# EAGLE design untitled (EAGLE 9.6.2)
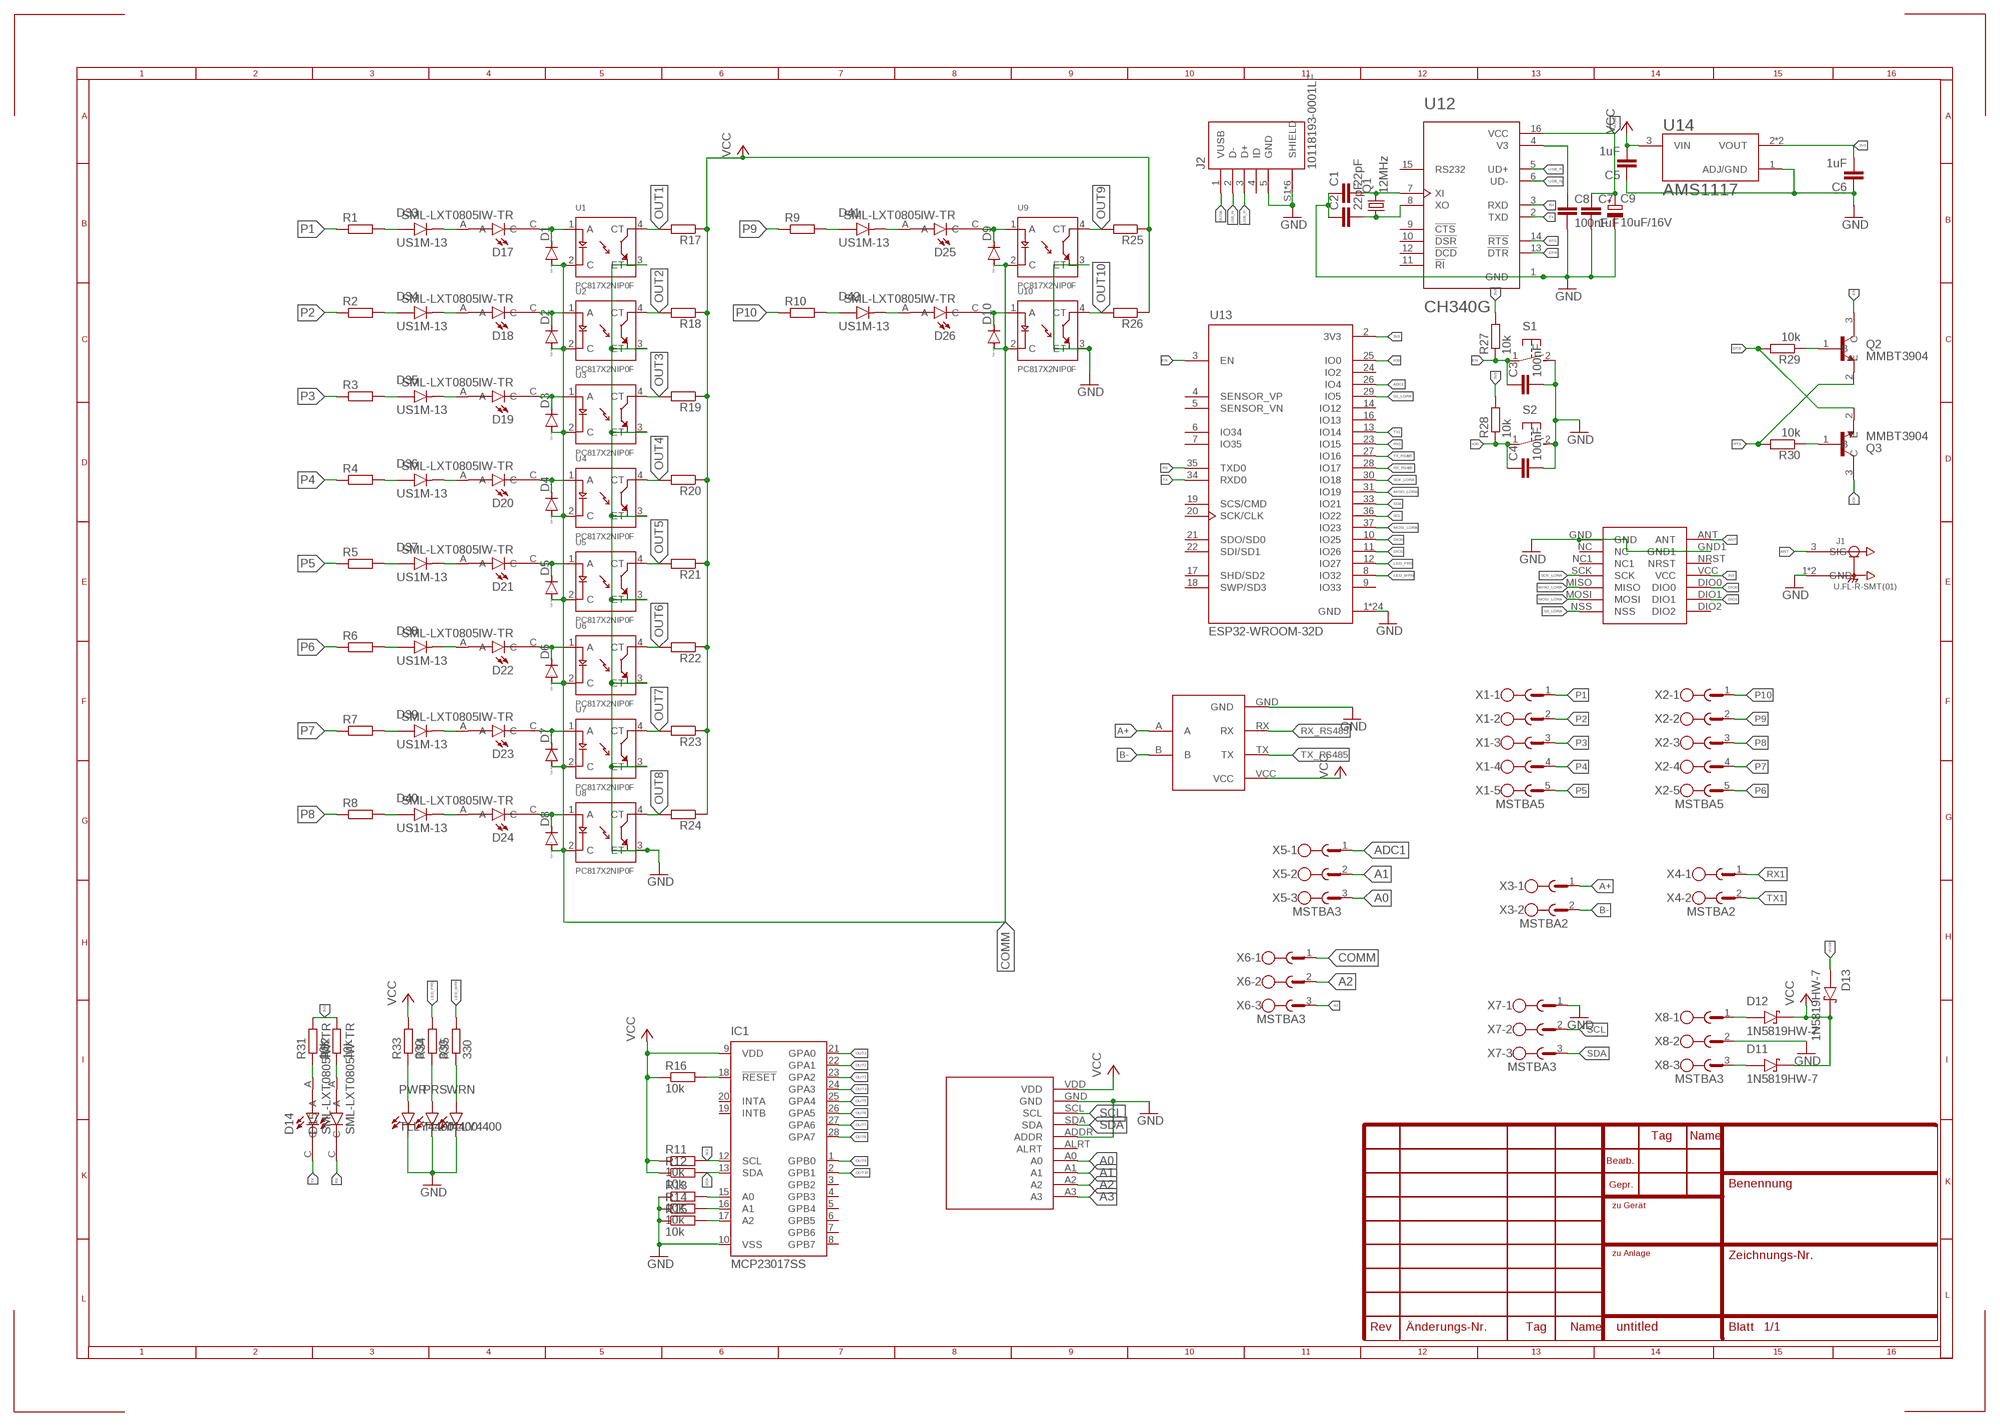
[diagram p0: schematic, sheet 1]

## Parts
ADS1  ADS1115  [ADS1115]
C1  22pF  C-EUC0805K  [C0805K]
C2  22pF  C-EUC0805K  [C0805K]
C3  100nF  C-EUC0805K  [C0805K]
C4  100nF  C-EUC0805K  [C0805K]
C5  1uF  C-EUC0805K  [C0805K]
C6  1uF  C-EUC0805K  [C0805K]
C7  1uF  C-EUC0805K  [C0805K]
C8  100nF  C-EUC0805K  [C0805K]
C9  10uF/16V  CPOL-EU153CLV-0505  [153CLV-0505]
D1  DIODE-SOD123  [SOD123]
D2  DIODE-SOD123  [SOD123]
D3  DIODE-SOD123  [SOD123]
D4  DIODE-SOD123  [SOD123]
D5  DIODE-SOD123  [SOD123]
D6  DIODE-SOD123  [SOD123]
D7  DIODE-SOD123  [SOD123]
D8  DIODE-SOD123  [SOD123]
D9  DIODE-SOD123  [SOD123]
D10  DIODE-SOD123  [SOD123]
D11  1N5819HW-7  [SOD3715X145N]
D12  1N5819HW-7  [SOD3715X145N]
D13  1N5819HW-7  [SOD3715X145N]
D14  SML-LXT0805IW-TR  [LEDC2012X120N]
D15  SML-LXT0805IW-TR  [LEDC2012X120N]
D17  SML-LXT0805IW-TR  [LEDC2012X120N]
D18  SML-LXT0805IW-TR  [LEDC2012X120N]
D19  SML-LXT0805IW-TR  [LEDC2012X120N]
D20  SML-LXT0805IW-TR  [LEDC2012X120N]
D21  SML-LXT0805IW-TR  [LEDC2012X120N]
D22  SML-LXT0805IW-TR  [LEDC2012X120N]
D23  SML-LXT0805IW-TR  [LEDC2012X120N]
D24  SML-LXT0805IW-TR  [LEDC2012X120N]
D25  SML-LXT0805IW-TR  [LEDC2012X120N]
D26  SML-LXT0805IW-TR  [LEDC2012X120N]
D33  US1M-13  [DIOM5226X240N]
D34  US1M-13  [DIOM5226X240N]
D35  US1M-13  [DIOM5226X240N]
D36  US1M-13  [DIOM5226X240N]
D37  US1M-13  [DIOM5226X240N]
D38  US1M-13  [DIOM5226X240N]
D39  US1M-13  [DIOM5226X240N]
D40  US1M-13  [DIOM5226X240N]
D41  US1M-13  [DIOM5226X240N]
D42  US1M-13  [DIOM5226X240N]
IC1  MCP23017SS  [SSOP28]
J1  U.FL-R-SMT(01)  [HRS_U.FL-R-SMT(01)]
J2  10118193-0001LF  [FCI_10118193-0001LF]
LORA-NICERF-V1  LORA-NICERF-V2  [LORA-NICERF-V2]
PRS  TLLY4400  [LED3MM]
PWR  TLLY4400  [LED3MM]
Q1  12MHz  CRYSTALSM49  [SM49]
Q2  MMBT3904  [SOT95P240X120-3N]
Q3  MMBT3904  [SOT95P240X120-3N]
R1  R-EU_0414/15  [0414/15]
R2  R-EU_0414/15  [0414/15]
R3  R-EU_0414/15  [0414/15]
R4  R-EU_0414/15  [0414/15]
R5  R-EU_0414/15  [0414/15]
R6  R-EU_0414/15  [0414/15]
R7  R-EU_0414/15  [0414/15]
R8  R-EU_0414/15  [0414/15]
R9  R-EU_0414/15  [0414/15]
R10  R-EU_0414/15  [0414/15]
R11  10k  R-EU_R0805  [R0805]
R12  10k  R-EU_R0805  [R0805]
R13  10k  R-EU_R0805  [R0805]
R14  10k  R-EU_R0805  [R0805]
R15  10k  R-EU_R0805  [R0805]
R16  10k  R-EU_R0805  [R0805]
R17  R-EU_R0805  [R0805]
R18  R-EU_R0805  [R0805]
R19  R-EU_R0805  [R0805]
R20  R-EU_R0805  [R0805]
R21  R-EU_R0805  [R0805]
R22  R-EU_R0805  [R0805]
R23  R-EU_R0805  [R0805]
R24  R-EU_R0805  [R0805]
R25  R-EU_R0805  [R0805]
R26  R-EU_R0805  [R0805]
R27  10k  R-EU_R0805  [R0805]
R28  10k  R-EU_R0805  [R0805]
R29  10k  R-EU_R0805  [R0805]
R30  10k  R-EU_R0805  [R0805]
R31  10k  R-EU_R0805  [R0805]
R32  10k  R-EU_R0805  [R0805]
R33  330  R-EU_R0805  [R0805]
R34  330  R-EU_R0805  [R0805]
R35  330  R-EU_R0805  [R0805]
S1  31-XX  [B3F-31XX]
S2  31-XX  [B3F-31XX]
TTL-RS1  TTL-RS485  [TTL-RS485]
U1  PC817X2NIP0F  [SOT254P975X400-4N]
U2  PC817X2NIP0F  [SOT254P975X400-4N]
U3  PC817X2NIP0F  [SOT254P975X400-4N]
U4  PC817X2NIP0F  [SOT254P975X400-4N]
U5  PC817X2NIP0F  [SOT254P975X400-4N]
U6  PC817X2NIP0F  [SOT254P975X400-4N]
U7  PC817X2NIP0F  [SOT254P975X400-4N]
U8  PC817X2NIP0F  [SOT254P975X400-4N]
U9  PC817X2NIP0F  [SOT254P975X400-4N]
U10  PC817X2NIP0F  [SOT254P975X400-4N]
U12  CH340G  [SOIC127P600X180-16N]
U13  ESP32-WROOM-32D  [MODULE_ESP32-WROOM-32D]
U14  AMS1117  [SOT229P700X180-4N]
WRN  TLLY4400  [LED3MM]
X1  MSTBA5  [MSTBA5]
X2  MSTBA5  [MSTBA5]
X3  MSTBA2  [MSTBA2]
X4  MSTBA2  [MSTBA2]
X5  MSTBA3  [MSTBA3]
X6  MSTBA3  [MSTBA3]
X7  MSTBA3  [MSTBA3]
X8  MSTBA3  [MSTBA3]

## Nets
3V3: C6.2 LORA-NICERF-V1.VCC R27.2 R28.2 R31.2 R32.2 U13.2(3V3) U14.2(VOUT) U14.4(VOUT)
A0: ADS1.A0 X5.3
A1: ADS1.A1 X5.2
A2: ADS1.A2 X6.2
A3: ADS1.A3 X6.3
A+: TTL-RS1.A X3.1
ADC1: U13.26(IO4) X5.1
ANT: J1.3(SIG) LORA-NICERF-V1.ANT
B-: TTL-RS1.B X3.2
COMM: D1.A D2.A D3.A D4.A D5.A D6.A D7.A D8.A D9.A D10.A U1.2(C) U2.2(C) U3.2(C) U4.2(C) U5.2(C) U6.2(C) U7.2(C) U8.2(C) U9.2(C) U10.2(C) X6.1
DIO0: LORA-NICERF-V1.DIO0 U13.10(IO25)
DIO1: LORA-NICERF-V1.DIO1 U13.11(IO26)
DTR: Q3.2(E) R29.2 U12.13(!DTR)
EN: C3.1 Q2.3(C) R27.1 S1.1(P) U13.3(EN)
GND: ADS1.ADDR ADS1.GND C1.1 C2.1 C3.2 C4.2 C5.1 C6.1 C7.2 C8.2 C9.- IC1.10(VSS) J1.1(GND) J1.2(GND) J2.5(GND) J2.S1(SHIELD) J2.S2(SHIELD) J2.S3(SHIELD) J2.S4(SHIELD) J2.S5(SHIELD) J2.S6(SHIELD) LORA-NICERF-V1.GND LORA-NICERF-V1.GND1 PRS.K(C) PWR.K(C) R13.1 R14.1 R15.1 S1.2(S) S2.2(S) TTL-RS1.GND U1.3(ET) U2.3(ET) U3.3(ET) U4.3(ET) U5.3(ET) U6.3(ET) U7.3(ET) U8.3(ET) U9.3(ET) U10.3(ET) U12.1(GND) U13.1(GND) U13.15(GND) U13.38(GND) U13.39_1(GND) U13.39_2(GND) U13.39_3(GND) U13.39_4(GND) U13.39_5(GND) U13.39_6(GND) U13.39_7(GND) U13.39_8(GND) U13.39_9(GND) U13.39_10(GND) U13.39_11(GND) U13.39_12(GND) U13.39_13(GND) U13.39_14(GND) U13.39_15(GND) U13.39_16(GND) U13.39_17(GND) U13.39_18(GND) U13.39_19(GND) U13.39_20(GND) U13.39_21(GND) U14.1(ADJ/GND) WRN.K(C) X7.1 X8.2
IO0: C4.1 Q3.3(C) R28.1 S2.1(P) U13.25(IO0)
LED_PRS: R34.2 U13.12(IO27)
LED_WRN: R35.2 U13.8(IO32)
MISO_LORA: LORA-NICERF-V1.MISO U13.31(IO19)
MOSI_LORA: LORA-NICERF-V1.MOSI U13.37(IO23)
N$1: D17.A D33.C(K)
N$2: D33.A R1.2
N$3: D1.C D17.C U1.1(A)
N$5: D34.A R2.2
N$6: D18.A D34.C(K)
N$7: D2.C D18.C U2.1(A)
N$8: D35.A R3.2
N$9: D19.A D35.C(K)
N$10: D3.C D19.C U3.1(A)
N$11: D36.A R4.2
N$12: D20.A D36.C(K)
N$13: D4.C D20.C U4.1(A)
N$15: D12.A X8.1
N$16: D11.A X8.3
N$17: D37.A R5.2
N$18: D21.A D37.C(K)
N$19: D5.C D21.C U5.1(A)
N$20: D38.A R6.2
N$21: D22.A D38.C(K)
N$22: D6.C D22.C U6.1(A)
N$23: IC1.18(!RESET) R16.2
N$24: C8.1 U12.4(V3)
N$25: D39.A R7.2
N$26: D23.A D39.C(K)
N$27: D7.C D23.C U7.1(A)
N$28: D40.A R8.2
N$29: D24.A D40.C(K)
N$30: D8.C D24.C U8.1(A)
N$31: PWR.A R33.1
N$32: IC1.15(A0) R13.2
N$33: D41.A R9.2
N$34: D25.A D41.C(K)
N$35: D9.C D25.C U9.1(A)
N$36: D42.A R10.2
N$37: D26.A D42.C(K)
N$38: D10.C D26.C U10.1(A)
N$39: IC1.16(A1) R14.2
N$40: IC1.17(A2) R15.2
N$41: PRS.A R34.1
N$42: D14.A R31.1
N$43: D15.A R32.1
N$44: R35.1 WRN.A
N$51: Q2.1(B) R29.1
N$52: Q3.1(B) R30.1
N$54: C1.2 Q1.2 U12.7(XI)
N$55: C2.2 Q1.1 U12.8(XO)
OUT1: IC1.21(GPA0) R17.2 U1.4(CT)
OUT2: IC1.22(GPA1) R18.2 U2.4(CT)
OUT3: IC1.23(GPA2) R19.2 U3.4(CT)
OUT4: IC1.24(GPA3) R20.2 U4.4(CT)
OUT5: IC1.25(GPA4) R21.2 U5.4(CT)
OUT6: IC1.26(GPA5) R22.2 U6.4(CT)
OUT7: IC1.27(GPA6) R23.2 U7.4(CT)
OUT8: IC1.28(GPA7) R24.2 U8.4(CT)
OUT9: IC1.1(GPB0) R25.2 U9.4(CT)
OUT10: IC1.2(GPB1) R26.2 U10.4(CT)
P1: R1.1 X1.1
P2: R2.1 X1.2
P3: R3.1 X1.3
P4: R4.1 X1.4
P5: R5.1 X1.5
P6: R6.1 X2.5
P7: R7.1 X2.4
P8: R8.1 X2.3
P9: R9.1 X2.2
P10: R10.1 X2.1
RTS: Q2.2(E) R30.2 U12.14(!RTS)
RX: D15.C U12.3(RXD) U13.35(TXD0)
RX1: U13.23(IO15) X4.1
RX_RS485: TTL-RS1.RX U13.28(IO17)
SCK_LORA: LORA-NICERF-V1.SCK U13.30(IO18)
SCL: ADS1.SCL IC1.12(SCL) R11.2 U13.36(IO22) X7.2
SDA: ADS1.SDA IC1.13(SDA) R12.2 U13.33(IO21) X7.3
SS_LORA: LORA-NICERF-V1.NSS U13.29(IO5)
TX: D14.C U12.2(TXD) U13.34(RXD0)
TX1: U13.13(IO14) X4.2
TX_RS485: TTL-RS1.TX U13.27(IO16)
USB_N: J2.2(D-) U12.6(UD-)
USB_P: J2.3(D+) U12.5(UD+)
VCC: ADS1.VDD C5.2 D11.C(K) D12.C(K) D13.C(K) IC1.9(VDD) R11.1 R12.1 R16.1 R17.1 R18.1 R19.1 R20.1 R21.1 R22.1 R23.1 R24.1 R25.1 R26.1 R33.2 TTL-RS1.VCC U14.3(VIN)
VUSB: C7.1 C9.+ D13.A J2.1(VUSB) U12.16(VCC)
Unconnected: ADS1.ALRT IC1.3(GPB2) IC1.4(GPB3) IC1.5(GPB4) IC1.6(GPB5) IC1.7(GPB6) IC1.8(GPB7) IC1.19(INTB) IC1.20(INTA) J2.4(ID) LORA-NICERF-V1.DIO2 LORA-NICERF-V1.NC LORA-NICERF-V1.NC1 LORA-NICERF-V1.NRST U12.9(!CTS) U12.10(!DSR) U12.11(!RI) U12.12(!DCD) U12.15(RS232) U13.4(SENSOR_VP) U13.5(SENSOR_VN) U13.6(IO34) U13.7(IO35) U13.9(IO33) U13.14(IO12) U13.16(IO13) U13.17(SHD/SD2) U13.18(SWP/SD3) U13.19(SCS/CMD) U13.20(SCK/CLK) U13.21(SDO/SD0) U13.22(SDI/SD1) U13.24(IO2)

## Library data of the parts
ADS1 = ds1115:ADS1115
C1-C8 = rcl:C-EU: CAPACITOR, European symbol; SPICEPREFIX: C
C9 = rcl:CPOL-EU: POLARIZED CAPACITOR, European symbol; SPICEPREFIX: C
D1-D10 = diode:DIODE-: DIODE
D11-D13 = 1N5819HW-7:1N5819HW-7: 1N5819HW Series 40 V 1 A Surface Mount Schottky Barrier Rectifier - SOD-123 Check availability <https://pricing.snapeda.com/parts/1N5819HW-7/Diodes%20Inc./view-part?ref=eda>; AVAILABILITY: In Stock; DESCRIPTION: Diode Schottky 40 V 1A Surface Mount SOD-123; MF: Diodes Inc.; MP: 1N5819HW-7; PACKAGE: SOD-123 Fairchild Semiconductor; PRICE: None; PURCHASE-URL: https://pricing.snapeda.com/search/part/1N5819HW-7/?ref=eda
D14 D15 D17-D26 = SML-LXT0805IW-TR:SML-LXT0805IW-TR: LED; Luminous Intensity:11µcd; Viewing Angle:140°; Forward Current:30mA; Forward Voltage:2V; Color:Red; LED Color:Red; Leaded Process Compatible:Yes; Lens Color:White; Mounting Type:Surface Mount ;RoHS Compliant: Yes Check availability <https://pricing.snapeda.com/parts/SML-LXT0805IW-TR/Lumex%20Opto/Components/view-part?ref=eda>; AVAILABILITY: In Stock; DESCRIPTION: Red - LED Indication - Discrete 2V 0805 (2012 Metric); MF: Lumex Opto/Components; MP: SML-LXT0805IW-TR; PACKAGE: 0805 Lumex; PRICE: None; PURCHASE-URL: https://pricing.snapeda.com/search/part/SML-LXT0805IW-TR/?ref=eda
D33-D42 = US1M-13:US1M-13: Diode, Fast Recovery, 1a, 1kv, Do-214ac-2, Full Reel Check availability <https://pricing.snapeda.com/parts/US1M-13/Diodes%20Incorporated/view-part?ref=eda>; AVAILABILITY: In Stock; DESCRIPTION: Diode Standard 1000 V 1A Surface Mount SMA; MF: Diodes Incorporated; MP: US1M-13; PACKAGE: DO-214AC-214 Diodes Incorporated; PRICE: None; PURCHASE-URL: https://pricing.snapeda.com/search/part/US1M-13/?ref=eda
IC1 = microchip:MCP23017: http://ww1.microchip.com/downloads/en/DeviceDoc/21952a.pdf Source: http://ww1.microchip.com/downloads/en/DeviceDoc/21952a.pdf; MF: MICROCHIP; MPN: MCP23017-E/SS; OC_FARNELL: 1467674; OC_NEWARK: 31K2960
J1 = U.FL-R-SMT_01_:U.FL-R-SMT(01): U.FL Series 6 Ghz 50 Ohm Ultra-small SMT Coaxial Cable Receptacle Check availability <https://pricing.snapeda.com/parts/U.FL-R-SMT%2801%29/Hirose/view-part?ref=eda>; AVAILABILITY: In Stock; DESCRIPTION: U.FL (UMCC) Connector Receptacle, Male Pin 50Ohm Surface Mount Solder. RF Connectors / Coaxial Connectors; MF: Hirose; MP: U.FL-R-SMT(01); PACKAGE: None; PRICE: None; PURCHASE-URL: https://pricing.snapeda.com/search/part/U.FL-R-SMT(01)/?ref=eda
J2 = 10118193-0001LF:10118193-0001LF: Micro USB B Type Receptacle Check availability <https://pricing.snapeda.com/parts/10118193-0001LF/FCI/view-part?ref=eda>; AVAILABILITY: In Stock; DESCRIPTION: USB - micro B USB 2.0 Receptacle Connector 5 Position Surface Mount, Right Angle; Through Hole; MF: FCI; MP: 10118193-0001LF; PACKAGE: None; PRICE: None; PURCHASE-URL: https://pricing.snapeda.com/search/part/10118193-0001LF/?ref=eda
LORA-NICERF-V1 = LORA-NICERF-V2:LORA-NICERF-V2
PRS PWR WRN = led:TLLY4400: Low Current (2mA) LED 3 mm Tinted Diffused Package color YELLOW Source: Data sheet <http://www.farnell.com/datasheets/391098.pdf>; MF: VISHAY SEMICONDUCTOR; OC_FARNELL: 1612439
Q1 = crystal:CRYSTAL: CRYSTAL; OC_FARNELL: unknown; OC_NEWARK: unknown
Q2 Q3 = MMBT3904:MMBT3904: MMBT3904 Series 40 V CE Breakdown 0.2 A NPN General Purpose Amplifier - SOT-23 Check availability <https://pricing.snapeda.com/parts/MMBT3904/ON%20Semiconductor/view-part?ref=eda>; AVAILABILITY: In Stock; DESCRIPTION: Bipolar (BJT) Transistor NPN 40 V 200 mA 300MHz 300 mW Surface Mount SOT-23-3 (TO-236); MF: ON Semiconductor; MP: MMBT3904; PACKAGE: SOT-23-3 Motorola; PRICE: None
R1-R35 = rcl:R-EU_: RESISTOR, European symbol; SPICEPREFIX: R
S1 S2 = switch-omron:31-XX: OMRON SWITCH; MPN: B3F-3100; OC_FARNELL: 959704; OC_NEWARK: 36M3582
TTL-RS1 = TTL-RS485:TTL-RS485
U1-U10 = PC817X2NIP0F:PC817X2NIP0F: PC817 Series 1 Channel 80 V 5000 Vrms General Purpose Photocoupler - DIP-4 Check availability <https://pricing.snapeda.com/parts/PC817X2NIP0F/Sharp%20Microelectronics/view-part?ref=eda>; AVAILABILITY: Not in stock; DESCRIPTION: Optoisolator Transistor Output 5000Vrms 1 Channel 4-SMD; MF: Sharp Microelectronics; MP: PC817X2NIP0F; PACKAGE: SMD-4 Sharp Microelectronics; PRICE: None
U12 = CH340G:CH340G: Check availability <https://pricing.snapeda.com/parts/Ch340G/WCH/view-part?ref=eda>; AVAILABILITY: Not in stock; DESCRIPTION: USB Interface Integrated Circuit; MF: WCH; MP: Ch340G; PACKAGE: None; PRICE: None
U13 = ESP32-WROOM-32D:ESP32-WROOM-32D: Bluetooth, WiFi 802.11b/g/n, Bluetooth v4.2 + EDR, Class 1, 2 and 3 Transceiver Module 2.4GHz ~ 2.5GHz Integrated, Trace Surface Mount Check availability <https://pricing.snapeda.com/parts/ESP32-WROOM-32D/Espressif%20Systems/view-part?ref=eda>; AVAILABILITY: In Stock; DESCRIPTION: Bluetooth, WiFi 802.11b/g/n, Bluetooth v4.2 +EDR, Class 1, 2 and 3 Transceiver Module 2.4GHz ~ 2.5GHz Integrated; MF: Espressif Systems; MP: ESP32-WROOM-32D; PACKAGE: Module Espressif Systems; PRICE: None; PURCHASE-URL: https://pricing.snapeda.com/search/part/ESP32-WROOM-32D/?ref=eda
U14 = AMS1117:AMS1117: Sot223/Pkg 1-Amp 5-Volt Low Drop Out Voltage Regulatator Check availability <https://pricing.snapeda.com/parts/AMS1117/Advanced%20Monolithic%20Systems/view-part?ref=eda>; AVAILABILITY: Not in stock; DESCRIPTION: 1A LOW DROPOUT VOLTAGE REGULATOR SOT-223; MF: Advanced Monolithic Systems; MP: AMS1117; PACKAGE: SOT-223 Seeed Technology; PRICE: None
X1 X2 = con-phoenix-508:MSTBA5: PHOENIX; MPN: 1757271; OC_FARNELL: 3705201; OC_NEWARK: 71C4164
X3 X4 = con-phoenix-508:MSTBA2: PHOENIX; MF: FARNELL; MPN: 1757242; OC_FARNELL: 3705171; OC_NEWARK: 71C4161
X5-X8 = con-phoenix-508:MSTBA3: PHOENIX; MF: FARNELL; MPN: 1757255; OC_FARNELL: 3705183; OC_NEWARK: 71C4162

## Board
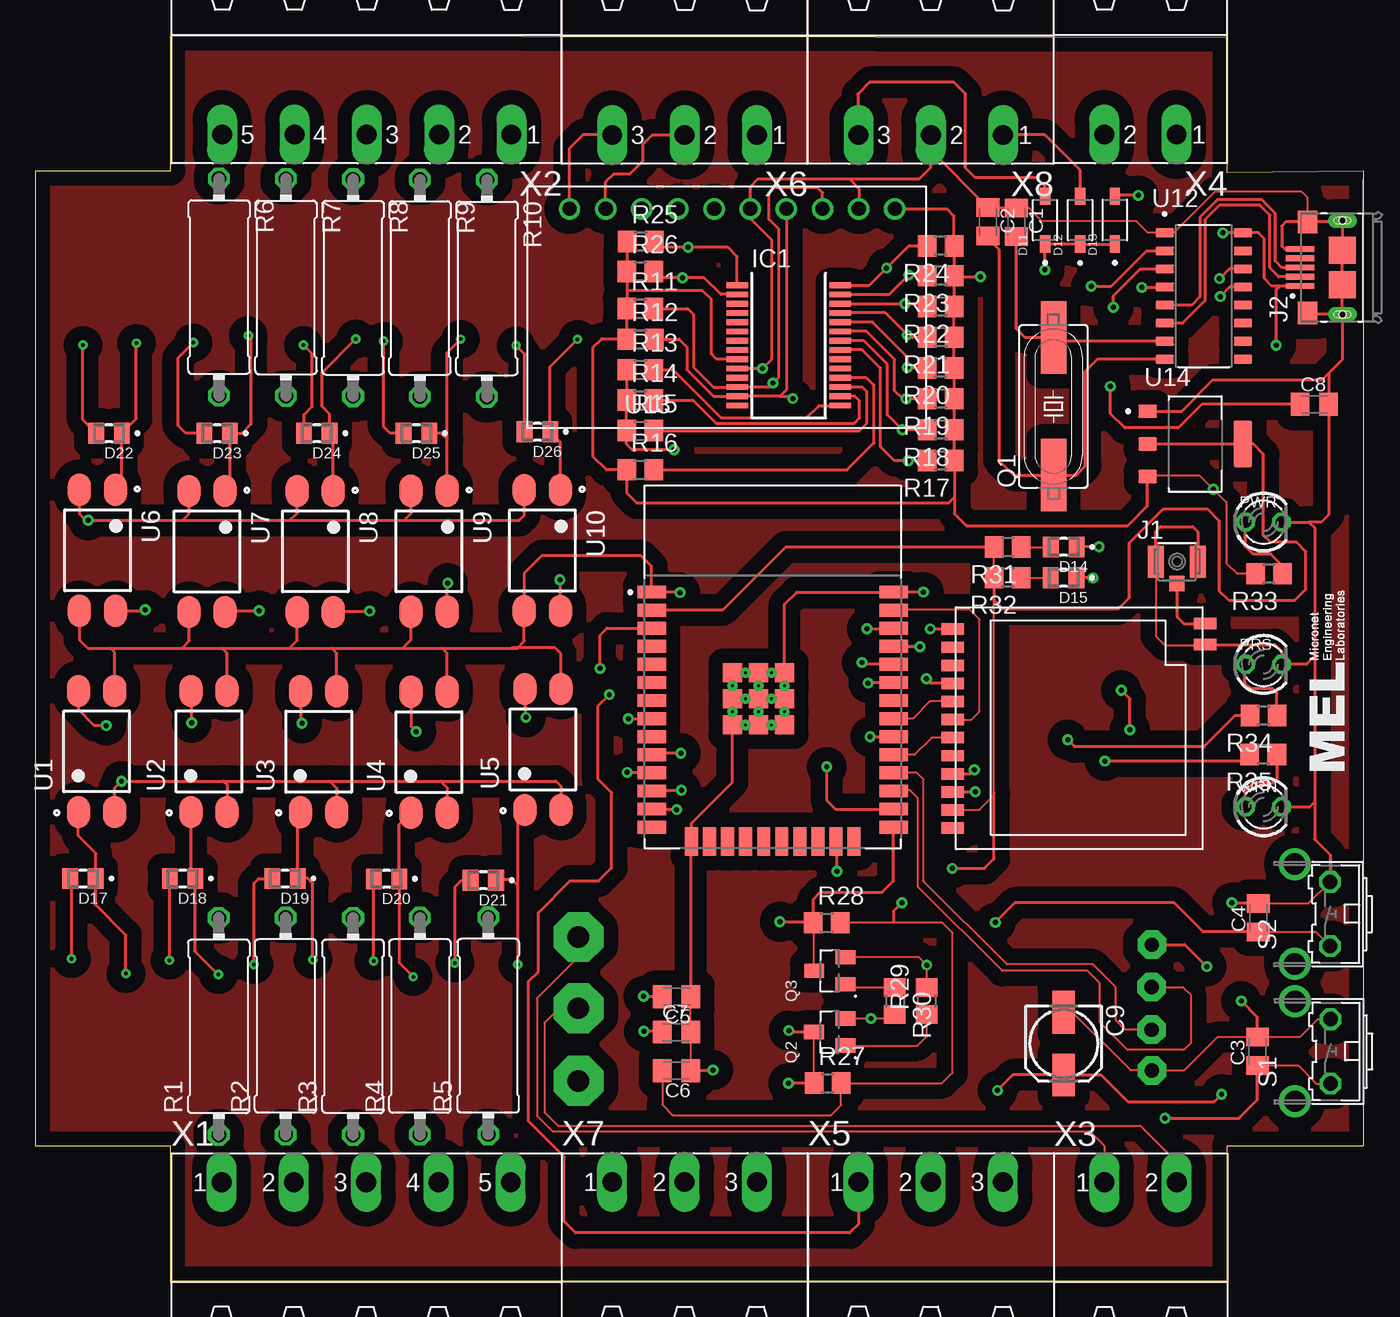
[diagram p1: board, top side]
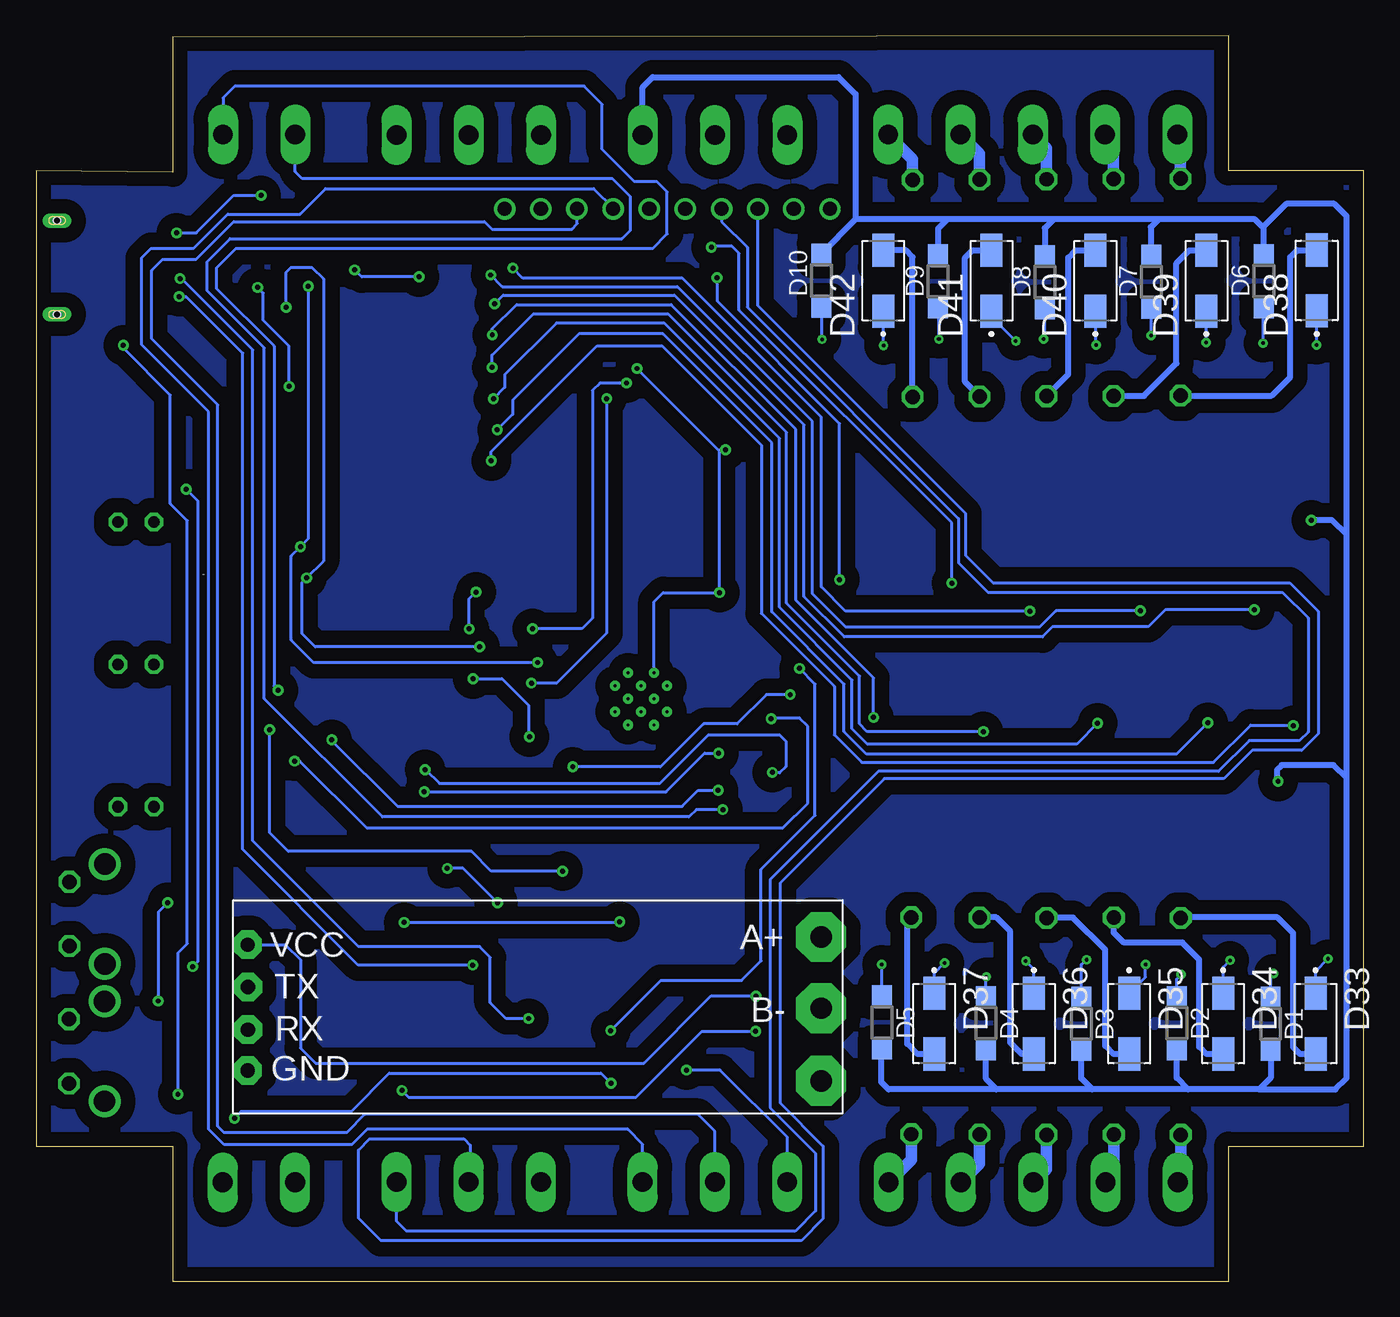
[diagram p2: board, bottom side, seen from below]

Size 93.3 x 87.5 mm. Coordinates in mm from the lower left corner, seen from the top.
Outline: 9.5,87.5 83.7,87.4 83.7,77.9 93.3,78 93.3,9.5 83.7,9.5 83.7,0 9.5,0 9.5,9.5 0,9.5 0,78 9.5,78 9.5,87.5
Copper layers (1*16): Top 0.035mm / dielectric 1.5mm / Bottom 0.035mm
Design rules "default *": minimum track width 6mil, minimum drill 0.25mm, track to track 6mil, track to pad 6mil, pad to pad 6mil, via to via 6mil, smd to smd 6mil, copper to edge 40mil, drill to drill 6mil, minimum pad ring 10mil, minimum via ring 8mil, stop-mask expansion 4mil, vias tented up to drill 0mil, thermal gap 10mil

### Footprints (pad centres in the part's own frame; a part is rotated, then mirrored left to right if it is on the bottom)
ADS1115 = drill 1: A0 -6.35,-1.27; A1 -6.35,-3.81; A2 -6.35,-6.35; A3 -6.35,-8.89; ADDR -6.35,3.81; ALRT -6.35,1.27; GND -6.35,11.43; SCL -6.35,8.89; SDA -6.35,6.35; VDD -6.35,13.97
C0805K = smd 1.3 x 1.6: 1 -1,0; 2 1,0
153CLV-0505 = smd 3 x 1.6: + 2.2,0; - -2.2,0
SOD123 = smd 1.4 x 1.4: A 1.9,0; C -1.9,0
SOD3715X145N = smd 1.21 x 0.73: A 1.68,0; C -1.68,0
LEDC2012X120N = smd 1.1 x 1.45: A 0.9,0; C -0.9,0
DIOM5226X240N = smd 2.33 x 1.55: A 2.135,0; C -2.135,0
SSOP28 = smd 0.4 x 1.5: 1 -4.225,-3.625; 2 -3.575,-3.625; 3 -2.925,-3.625; 4 -2.275,-3.625; 5 -1.625,-3.625; 6 -0.975,-3.625; 7 -0.325,-3.625; 8 0.325,-3.625; 9 0.975,-3.625; 10 1.625,-3.625; 11 2.275,-3.625; 12 2.925,-3.625; 13 3.575,-3.625; 14 4.225,-3.625; 15 4.225,3.625; 16 3.575,3.625; 17 2.925,3.625; 18 2.275,3.625; 19 1.625,3.625; 20 0.975,3.625; 21 0.325,3.625; 22 -0.325,3.625; 23 -0.975,3.625; 24 -1.625,3.625; 25 -2.275,3.625; 26 -2.925,3.625; 27 -3.575,3.625; 28 -4.225,3.625
HRS_U.FL-R-SMT(01) = smd 1.1 x 2.25: 1 -1.475,0; 2 1.475,0 | smd 1.05 x 1.1: 3 0,-1.55
FCI_10118193-0001LF = smd 0.4 x 2: 1 -1.3,2.975; 2 -0.65,2.975; 3 0,2.975; 4 0.65,2.975; 5 1.3,2.975 | smd 1.6 x 1.4: S1 -3.2,2.45; S2 3.2,2.45 | smd 1.9 x 1.9: S3 1.2,0; S4 -1.2,0 | drill 0.5 pad 0.9 long: S5 -3.3,0; S6 3.3,0 | hole 0.5: -3.3,0; 3.3,0
LORA-NICERF-V2 = smd 1.6 x 0.8: ANT 9.17,6.81; DIO0 -8.57,-5.03; DIO1 -8.57,-3.76; DIO2 -8.57,-2.49; GND -8.57,6.4; GND1 9.17,5.31; MISO -8.57,1.32; MOSI -8.57,0.05; NC -8.57,5.13; NC1 -8.57,3.86; NRST -8.57,-7.57; NSS -8.57,-1.22; SCK -8.57,2.59; VCC -8.57,-6.3
LED3MM = drill 0.813 octagon: A -1.27,0; K 1.27,0
SM49 = smd 5.08 x 1.778: 1 -4.826,0; 2 4.826,0
SOT95P240X120-3N = smd 1 x 1.4: 1 -0.95,-1.1; 2 0.95,-1.1; 3 0,1.1
0414/15 = drill 1.016 octagon: 1 -7.62,0; 2 7.62,0
R0805 = smd 1.3 x 1.5: 1 -0.95,0; 2 0.95,0
B3F-31XX = drill 1.016 octagon: 1 -2.261,-1.245; 2 2.261,-1.245 | drill 1.499 pad 2.159: 3 -3.505,1.245; 4 3.505,1.245
TTL-RS485 = drill 1.5 pad 3.5 octagon: A -19.7,-6; B -19.7,-1; P$7 -19.7,4.1 | drill 1 pad 2 octagon: GND 20.6,3.37; RX 20.581,0.505; TX 20.583,-2.493; VCC 20.6,-5.47
SOT254P975X400-4N = smd 2.25 x 1.6: 1 -4.25,1.27; 2 -4.25,-1.27; 3 4.25,-1.27; 4 4.25,1.27
SOIC127P600X180-16N = smd 1.31 x 0.62: 1 -2.75,4.445; 2 -2.75,3.175; 3 -2.75,1.905; 4 -2.75,0.635; 5 -2.75,-0.635; 6 -2.75,-1.905; 7 -2.75,-3.175; 8 -2.75,-4.445; 9 2.75,-4.445; 10 2.75,-3.175; 11 2.75,-1.905; 12 2.75,-0.635; 13 2.75,0.635; 14 2.75,1.905; 15 2.75,3.175; 16 2.75,4.445
MODULE_ESP32-WROOM-32D = smd 2 x 0.9: 1 -8.5,5.26; 2 -8.5,3.99; 3 -8.5,2.72; 4 -8.5,1.45; 5 -8.5,0.18; 6 -8.5,-1.09; 7 -8.5,-2.36; 8 -8.5,-3.63; 9 -8.5,-4.9; 10 -8.5,-6.17; 11 -8.5,-7.44; 12 -8.5,-8.71; 13 -8.5,-9.98; 14 -8.5,-11.25; 25 8.5,-11.25; 26 8.5,-9.98; 27 8.5,-8.71; 28 8.5,-7.44; 29 8.5,-6.17; 30 8.5,-4.9; 31 8.5,-3.63; 32 8.5,-2.36; 33 8.5,-1.09; 34 8.5,0.18; 35 8.5,1.45; 36 8.5,2.72; 37 8.5,3.99; 38 8.5,5.26 | smd 0.9 x 2: 15 -5.715,-12.25; 16 -4.445,-12.25; 17 -3.175,-12.25; 18 -1.905,-12.25; 19 -0.635,-12.25; 20 0.635,-12.25; 21 1.905,-12.25; 22 3.175,-12.25; 23 4.445,-12.25; 24 5.715,-12.25 | smd 1.33 x 1.33: 39_1 -2.835,-0.405; 39_2 -1,-0.405; 39_3 0.835,-0.405; 39_4 -2.835,-2.24; 39_5 -1,-2.24; 39_6 0.835,-2.24; 39_7 -2.835,-4.075; 39_8 -1,-4.075; 39_9 0.835,-4.075 | drill 0.2 pad 0.3: 39_10 -1.917,-0.405; 39_11 -0.083,-0.405; 39_12 -2.835,-1.323; 39_13 -1,-1.323; 39_14 0.835,-1.323; 39_15 -1.917,-2.24; 39_16 -0.083,-2.24; 39_17 -2.835,-3.158; 39_18 -1,-3.158; 39_19 0.835,-3.158; 39_20 -1.917,-4.075; 39_21 -0.083,-4.075
SOT229P700X180-4N = smd 1.31 x 0.93: 1 -3.345,2.29; 2 -3.345,0; 3 -3.345,-2.29 | smd 1.31 x 3.24: 4 3.345,0
MSTBA5 = drill 1.397 long: 1 -10.16,5.08; 2 -5.08,5.08; 3 0,5.08; 4 5.08,5.08; 5 10.16,5.08
MSTBA2 = drill 1.397 long: 1 -2.54,5.08; 2 2.54,5.08
MSTBA3 = drill 1.397 long: 1 -5.08,5.08; 2 0,5.08; 3 5.08,5.08

### Placement (x,y rotation side)
ADS1  46.41,68.99 270 top
C1  68.92,74.4 270 top
C2  66.91,74.42 270 top
C3  85.86,16.17 90 top
C4  85.92,25.54 90 top
C5  45.04,19.98 180 top
C6  45.04,14.78 180 top
C7  45.02,17.51 0 top
C8  89.86,61.61 0 top
C9  72.24,16.7 270 top
D1  6.56,18.09 270 bottom
D2  13.16,18.14 270 bottom
D3  19.86,18.09 270 bottom
D4  26.56,18.14 270 bottom
D5  33.86,18.19 270 bottom
D6  7.04,70.26 90 bottom
D7  14.94,70.21 90 bottom
D8  22.42,70.19 90 bottom
D9  29.92,70.24 90 bottom
D10  38.12,70.29 90 bottom
D11  70.93,74.54 90 top
D12  73.4,74.54 90 top
D13  75.84,74.54 90 top
D14  72.24,51.59 180 top
D15  72.23,49.42 180 top
D17  3.33,28.29 180 top
D18  10.33,28.29 180 top
D19  17.53,28.29 180 top
D20  24.66,28.27 180 top
D21  31.46,28.17 180 top
D22  5.16,59.57 180 top
D23  12.76,59.57 180 top
D24  19.76,59.57 180 top
D25  26.76,59.57 180 top
D26  35.26,59.67 180 top
D33  3.39,18.1 270 bottom
D34  9.89,18.1 270 bottom
D35  16.49,18.1 270 bottom
D36  23.19,18.1 270 bottom
D37  30.19,18.1 270 bottom
D38  3.31,70.3 90 bottom
D39  11.07,70.28 90 bottom
D40  18.87,70.28 90 bottom
D41  26.17,70.28 90 bottom
D42  33.77,70.28 90 bottom
IC1  52.92,65.74 270 top
J1  80.19,50.56 0 top
J2  91.82,71.21 90 top
LORA-NICERF-V1  73,39.41 0 top
PRS  86.28,43.33 0 top
PWR  86.28,53.33 0 top
Q1  71.52,61.46 90 top
Q2  55.8,17.51 90 top
Q3  55.81,21.82 90 top
R1  12.87,17.91 90 top
R2  17.57,17.93 90 top
R3  22.31,17.91 90 top
R4  27.01,17.93 90 top
R5  31.81,17.95 90 top
R6  12.89,69.83 270 top
R7  17.59,69.81 270 top
R8  22.31,69.79 270 top
R9  27.01,69.77 270 top
R10  31.71,69.75 270 top
R11  42.49,68.33 0 top
R12  42.51,66.17 0 top
R13  42.5,64.03 0 top
R14  42.49,61.89 0 top
R15  42.49,59.76 0 top
R16  42.47,57 0 top
R17  63.6,57.64 180 top
R18  63.59,59.81 180 top
R19  63.6,62 180 top
R20  63.59,64.16 180 top
R21  63.59,66.31 180 top
R22  63.59,68.46 180 top
R23  63.59,70.63 180 top
R24  63.59,72.73 180 top
R25  42.52,73.04 0 top
R26  42.5,70.93 0 top
R27  55.65,13.92 0 top
R28  55.59,25.19 0 top
R29  62.62,19.68 90 top
R30  60.37,19.68 270 top
R31  68.31,51.57 180 top
R32  68.3,49.42 180 top
R33  86.66,49.69 180 top
R34  86.28,39.73 180 top
R35  86.26,37 180 top
S1  89.74,16.15 90 top
S2  89.71,25.8 90 top
TTL-RS1  57.84,18.18 180 bottom
U1  4.29,37.22 90 top
U2  12.19,37.21 90 top
U3  19.89,37.2 90 top
U4  27.65,37.17 90 top
U5  35.65,37.36 90 top
U6  4.35,51.35 270 top
U7  12.05,51.26 270 top
U8  19.65,51.27 270 top
U9  27.65,51.28 270 top
U10  35.61,51.33 270 top
U12  82.09,69.21 0 top
U13  51.79,43.15 0 top
U14  81.48,58.82 0 top
WRN  86.28,33.33 0 top
X1  23.23,1.88 0 top
X2  23.27,85.63 180 top
X3  77.64,1.87 0 top
X4  77.63,85.63 180 top
X5  62.9,1.9 0 top
X6  45.6,85.6 180 top
X7  45.6,1.9 0 top
X8  62.9,85.6 180 top

### Tracks (layer width: path | path; a pad name or v marks a point on that pad's centre or on a via)
3V3  (via drill 0.35)
  Top 0.152: R31.2 67.35,51.56 R32.2 67.35,34.34 67.35,34.14 66.32,33.11 LORA-NICERF-V1.VCC | C6.2 44.04,12.41 44.77,11.68 55.9,11.68 56.6,12.37 R27.2 63.7,13.92 64.43,14.65 64.43,24.48 63.72,25.19 60.32,25.19 R28.2
  Top 0.203: R31.2 52.69,51.57 48.26,47.14 U13.2 | U14.2 U14.4 85.55,58.82 86.28,58.09 86.28,52.41 86.79,51.91 88.61,51.91 89.27,51.25 89.27,48.63 88.48,47.84 83.83,47.84 83.15,48.52 83.15,53.44 82.33,54.26 79.22,54.26 76.86,51.89 76.86,48.02 76.08,47.23 67.94,47.23 67.35,47.82 R32.2 | 60.32,25.19 60.32,26.03 v60.88,26.59 | v64.41,29 66.68,29 67.35,29.67 67.35,34.34
  Bottom 0.203: v60.88,26.59 63.29,29 v64.41,29
A0
  Bottom 0.203: ADS1.A0 45.14,74.43 43.33,72.62 43.33,68.43 28.48,53.58 28.48,50.46 26.42,48.39 5.72,48.39 3.92,46.6 3.92,38.58 4.53,37.98 8.06,37.98 10.22,35.83 34.11,35.83 41.73,28.21 41.73,12.2 38.52,8.99 38.52,4.94 39.94,3.52 67.27,3.52 67.98,4.23 X5.3
A1
  Bottom 0.203: ADS1.A1 42.6,68.55 27.99,53.94 27.99,50.99 26.06,49.06 5.22,49.06 3.21,47.05 3.21,38.46 4.37,37.3 7.86,37.3 9.85,35.3 33.7,35.3 41.03,27.97 41.03,12.53 38,9.5 38,4.4 39.53,2.86 69.07,2.86 70.65,4.44 70.65,9.22 69.87,10 63.23,10 62.79,9.56 62.79,7.09 X5.2
A2
  Top 0.203: ADS1.A2 40.06,77.22 40.63,77.79 41.76,77.79 42.67,78.7 42.67,79.86 43.33,80.52 X6.2
A3
  Top 0.203: ADS1.A3 37.52,79.57 38.51,80.57 40.47,80.57 X6.3
A+
  Top 0.152: TTL-RS1.A 38.14,22.8 35.23,19.89 35.23,11.63 36.32,10.54 74.07,10.54 75.1,9.51 X3.1
ADC1  (via drill 0.35)
  Top 0.203: X5.1 57.82,4.01 57.2,3.4 37.96,3.4 37.15,4.21 37.15,8.74 34.65,11.24 34.65,21.08 35.33,21.76 35.33,25.9 37.55,28.13 39.57,28.13 40.48,29.04 40.48,34.32 39.54,35.26 39.54,40.44 v40.31,41.22 | v40.31,41.22 | v55.59,36.13 55.59,33.77 56.2,33.17 U13.26
  Bottom 0.203: v40.31,41.22 41.99,41.22 44.05,39.16 46.4,39.16 49.43,36.13 v55.59,36.13
ANT
  Top 0.203: J1.3 80.19,46.67 80.67,46.19 82.15,46.19 LORA-NICERF-V1.ANT
B-
  Top 0.152: TTL-RS1.B 36.79,19.18 35.76,18.15 35.76,11.89 36.72,10.93 77.61,10.93 80.18,8.36 X3.2
COMM  (via drill 0.35)
  Top 0.203: U6.2 3.08,53.91 3.54,53.45 v3.69,53.45 10.32,53.45 | U7.2 10.78,53.91 10.32,53.45 | 10.32,53.45 17.86,53.45 | U8.2 18.38,53.97 17.86,53.45 | 17.86,53.45 25.89,53.45 | 25.89,53.45 26.39,53.95 26.39,55.52 U9.2 | 25.89,53.45 33.99,53.45 34.34,53.8 U10.2 | U1.2 5.56,34.65 v6.03,35.13 13.2,35.13 | U2.2 13.46,34.86 13.2,35.13 | 13.2,35.13 20.67,35.13 | U3.2 21.16,34.64 20.67,35.13 | 20.67,35.13 28.44,35.13 | U4.2 28.92,34.65 28.44,35.13 | 28.44,35.13 36.57,35.13 36.92,34.78 U5.2
  Bottom 0.406: D1.A 6.56,14.28 7.36,13.48 | 7.36,13.48 12.36,13.48 | D2.A 13.16,14.29 12.36,13.48 | 12.36,13.48 19.09,13.48 | D3.A 19.86,14.25 19.09,13.48 | 19.09,13.48 25.83,13.48 | D4.A 26.56,14.22 25.83,13.48 | 25.83,13.48 33.4,13.48 33.9,13.99 33.9,16.25 D5.A | D6.A 7.04,73.97 7.11,74.04 | 7.11,74.04 7.66,74.6 14.43,74.6 | 14.43,74.6 14.97,74.05 14.97,72.14 D7.A | 14.43,74.6 21.8,74.6 | D8.A 22.42,73.97 21.8,74.6 | 21.8,74.6 29.27,74.6 | 29.27,74.6 29.93,73.94 29.93,72.15 D9.A | 29.27,74.6 35.71,74.6 | 35.71,74.6 D10.A | 7.36,13.48 2,13.48 1.22,14.27 1.22,35.36 | 1.22,35.36 2.12,36.26 5.78,36.26 6.11,35.93 6.11,35.23 6.03,35.15 v6.03,35.13 | 1.22,35.36 1.22,52.42 | 1.22,52.42 2.27,53.47 3.69,53.47 v3.69,53.45 | X6.1 50.68,83.89 49.99,84.58 36.91,84.58 35.71,83.38 35.71,74.6 | 1.22,52.42 1.22,74.82 2.08,75.68 5.47,75.68 7.11,74.04
DIO0  (via drill 0.35)
  Top 0.203: LORA-NICERF-V1.DIO0 v66.02,34.38 | v45.34,37.09 43.4,37.09 U13.10
  Bottom 0.203: v66.02,34.38 49.04,34.38 46.32,37.09 v45.34,37.09
DIO1  (via drill 0.35)
  Top 0.203: LORA-NICERF-V1.DIO1 65.67,35.65 v65.96,35.94 | v41.57,35.75 43.26,35.75 U13.11
  Bottom 0.203: v65.96,35.94 65.92,35.94 64.97,34.98 49.47,34.98 46.06,38.39 41.07,38.39 40.61,37.94 40.61,36.15 41.05,35.71 41.54,35.71 v41.57,35.75
DTR  (via drill 0.35)
  Top 0.152: R29.2 v62.62,22.21 62.06,22.77 Q3.2
  Top 0.203: U12.13 83.92,69.84 83.25,69.17 v83.25,69.17
  Bottom 0.203: v62.62,22.21 70.66,22.21 78.78,30.33 78.78,65.19 82.75,69.17 v83.25,69.17
EN  (via drill 0.35)
  Top 0.152: C3.1 88.71,15.16 89.99,13.89 S1.1 | R27.1 Q2.3
  Top 0.203: R27.1 v52.91,13.92 | v79.36,11.45 84.55,11.45 85.86,12.75 C3.1 | Q2.3 53.02,17.51 v52.92,17.61 | v39.66,43.05 39.66,45.39 40.15,45.88 U13.3
  Bottom 0.203: v52.91,13.92 53.61,14.62 68.48,14.62 71.18,11.92 78.9,11.92 v79.36,11.45 | v52.92,17.61 49.4,21.14 43.72,21.14 42.36,22.5 42.36,28.94 38.56,32.74 38.56,41.95 v39.66,43.05
GND  (via drill 0.35)
  Top 0.152: J1.1 78.72,45.32 79.36,44.68 82.13,44.68 LORA-NICERF-V1.GND1 | S1.2 90.11,18.41 88.86,17.16 C3.2 83.06,17.16 80.7,14.81 TTL-RS1.GND 76.96,14.81 72.86,18.91 72.25,18.91 C9.- | C4.2 86.03,26.54 89.43,26.54 S2.2 | C1.1 69.78,75.4 70.71,74.48 77.33,74.48 78.16,73.65 U12.1 79.99,73.65 82.86,76.52 88.98,76.52 89.37,76.12 J2.S2 | C6.1 46.04,17.49 C7.2 46.02,19.96 C5.1
  Top 0.203: C1.1 68.9,75.42 C2.1 62.9,79.43 | R13.1 R14.1 R15.1 41.54,58.78 41.91,58.4 v44.86,58.4 | U6.3 3.08,45.06 3.67,44.48 5.26,44.48 | 5.26,44.48 10.28,44.48 | 10.28,44.48 10.8,44.99 10.8,46.98 U7.3 | 10.28,44.48 13.1,44.48 | 13.1,44.48 17.83,44.48 | U8.3 18.38,45.03 17.83,44.48 | 17.83,44.48 20.8,44.48 | 20.8,44.48 25.8,44.48 | U9.3 26.38,45.05 25.8,44.48 | 25.8,44.48 28.55,44.48 | 28.55,44.48 33.42,44.48 | 33.42,44.48 33.85,44.48 34.34,44.97 U10.3 34.34,49.74 35.55,50.96 42.56,50.96 43.29,50.22 U13.1 45.25,48.41 v45.28,48.38 | U5.3 36.92,44.08 36.5,44.5 33.45,44.5 33.42,44.48 | U4.3 28.92,44.1 28.55,44.48 | U3.3 21.16,44.11 20.8,44.48 | U2.3 13.46,44.12 13.1,44.48 | U1.3 5.56,44.17 5.26,44.48 | LORA-NICERF-V1.GND1 87.09,44.72 87.55,44.26 PRS.K 89.29,43.33 89.88,43.91 | PWR.K 89.47,53.33 | 89.47,53.33 89.88,52.92 89.88,43.91 | 89.88,43.91 89.88,33.68 | 89.88,33.68 89.49,33.29 87.6,33.29 WRN.K | 89.88,33.68 89.88,31.05 90.96,29.96 S2.2 | J1.1 78.72,52.7 79.03,53.02 81.3,53.02 81.67,52.65 J1.2 | 89.47,53.33 90.34,53.33 90.86,53.85 C8.2 90.86,63.77 | J2.S5 91.82,64.73 90.86,63.77 | J2.S5 89.47,67.91 J2.S1 | J2.S5 J2.S4 J2.S3 J2.S6 91.72,74.41 J2.S2 87.85,74.41 87.55,74.11 87.55,72.72 87.76,72.51 J2.5 | 62.9,79.43 X8.2 | 57.17,77.43 50.75,77.43 50.22,76.9 ADS1.ADDR 50.22,74.65 51.71,73.16 51.71,64.75 v51.08,64.12 IC1.10 | 57.17,77.43 57.87,76.73 57.87,75.37 ADS1.GND | 57.17,77.43 62.09,77.43 62.9,78.24 62.9,79.43 | U14.1 80.53,61.11 82.73,63.31 90.41,63.31 90.86,63.77 | C5.1 46.04,30.02 46.15,30.13 46.15,30.84 U13.15 46.08,32.16 48.96,35.04 U13.39_7 | v47.6,14.84 47.55,14.78 C6.1 | LORA-NICERF-V1.GND 62.88,45.81 v62.86,45.83
  Top 0.203: v62.38,48.41 U13.38 | U13.38 | U13.39_3 52.63,47.56 53.48,48.41 U13.38 | C3.2 85.86,18.55 v84.71,19.69 | v84.06,26.59 85.98,26.59 86.03,26.54
  Top 0.406: 48.99,42.75 U13.39_10 50.76,42.75 | 48.99,42.75 U13.39_1 | 50.76,42.75 U13.39_2 U13.39_11 U13.39_3 U13.39_14 52.63,40.92 | 52.63,40.92 U13.39_6 U13.39_19 U13.39_9 U13.39_21 U13.39_8 | 50.76,42.75 50.76,41.87 U13.39_13 U13.39_5 | 48.99,42.75 48.96,42.72 U13.39_12 U13.39_4 | U13.39_4 U13.39_15 50.72,40.91 | 50.72,40.91 U13.39_5 | U13.39_5 U13.39_16 51.72,40.92 52.63,40.92 | 50.72,40.91 50.72,40.07 U13.39_18 U13.39_8 | U13.39_4 U13.39_17 U13.39_7 U13.39_20 U13.39_8
  Bottom 0.203: X7.1 40.52,10.13 45.23,14.84 v47.6,14.84 | U13.39_10 49.88,47.74 49.24,48.38 v45.28,48.38 45.28,58.24 45.12,58.4 v44.86,58.4 45.38,58.4 51.08,64.1 v51.08,64.12 | v62.86,45.83 62.86,47.95 62.4,48.41 v62.38,48.41 | v84.06,26.59 84.71,25.94 v84.71,19.69
IO0  (via drill 0.35)
  Top 0.152: C4.1 89.96,24.54 S2.1 | Q3.3 54.71,24.99 54.71,25.13 R28.1
  Top 0.203: R28.1 54.64,26.83 55.13,27.31 59.48,27.31 60.29,28.13 U13.25 | C4.1 82.05,24.54 80,26.58 68.82,26.58 v67.44,25.2 | v52.29,25.25 54.45,25.25 54.71,24.99
  Bottom 0.203: v67.44,25.2 52.34,25.2 v52.29,25.25
LED_PRS  (via drill 0.35)
  Top 0.203: v72.52,38.04 73.02,37.55 82.09,37.55 84.28,39.73 R34.2 | v45.37,34.49 45.33,34.44 U13.12
  Bottom 0.203: v72.52,38.04 72.52,37.98 67.89,33.36 47.91,33.36 46.77,34.49 v45.37,34.49
LED_WRN  (via drill 0.35)
  Top 0.203: R35.2 84.84,36.53 75.68,36.53 75.67,36.54 v75.13,36.54 | v41.65,39.52 U13.8
  Bottom 0.203: v75.13,36.54 74.77,36.54 70.07,31.85 40.82,31.85 39.08,33.59 39.08,38.98 39.65,39.56 41.61,39.56 v41.65,39.52
MISO_LORA
  Top 0.152: LORA-NICERF-V1.MISO 62.85,40.73 61.65,39.52 U13.31
MOSI_LORA
  Top 0.152: LORA-NICERF-V1.MOSI 65.76,39.46 66.32,40.02 66.32,46.5 65.64,47.18 60.33,47.18 U13.37
N$1  (via drill 0.25)
  Top 0.203: v2.53,22.66 2.53,28.19 D17.A
  Bottom 0.203: D33.C 3.39,21.78 2.52,22.64 v2.52,22.65 v2.53,22.66
N$2
  Bottom 0.406: D33.A 4.49,15.96 4.98,16.46 4.98,24.46 6.08,25.57 12.83,25.57 R1.2
N$3  (via drill 0.25)
  Top 0.203: v6.35,21.61 6.35,24.31 4.22,26.43 D17.C 4.23,30.07 2.99,31.31 2.99,32.94 U1.1
  Bottom 0.203: D1.C 6.56,21.38 v6.34,21.6 v6.35,21.61
N$4
  pour Bottom (isolate 1.016): 0,78 9.5,78 9.5,87.5 83.7,87.5 83.7,78 93.3,78 93.3,9.5 83.7,9.5 83.7,0 9.5,0 9.5,9.5 0,9.5
N$5
  Bottom 0.406: D34.A 11.07,15.96 11.57,16.47 11.57,22.6 12.76,23.79 16.86,23.79 17.57,24.5 R2.2
N$6  (via drill 0.25)
  Top 0.203: v9.42,22.55 9.42,28.28 D18.A
  Bottom 0.203: D34.C 9.89,22.07 v9.42,22.55
N$7  (via drill 0.25)
  Top 0.203: v12.85,21.54 11.23,23.16 D18.C 10.92,28.6 U2.1
  Bottom 0.203: D2.C 13.16,21.23 v12.85,21.54
N$8
  Bottom 0.406: D35.A 17.6,15.96 18.18,16.55 18.18,23.29 20.44,25.55 22.29,25.55 R3.2
N$9  (via drill 0.25)
  Top 0.203: D19.A 15.67,28.29 15.35,27.97 v15.35,22.24
  Bottom 0.203: D35.C 15.35,21.38 v15.35,22.24
N$10  (via drill 0.25)
  Top 0.203: v19.48,22.59 19.48,27.94 19.1,28.32 18.46,28.32 D19.C 18.43,32.76 U3.1
  Bottom 0.203: D3.C 19.86,22.24 19.5,22.6 v19.49,22.6 v19.48,22.59
N$11
  Bottom 0.406: D36.A 24.05,15.96 24.85,16.77 24.85,24.57 25.84,25.56 R4.2
N$12  (via drill 0.25)
  Top 0.203: v23.76,22.5 D20.A
  Bottom 0.203: D36.C 23.19,21.93 v23.76,22.5
N$13  (via drill 0.25)
  Top 0.203: v26.53,21.39 25.56,22.36 D20.C 25.56,32.1 U4.1
  Bottom 0.203: D4.C 26.56,21.36 v26.53,21.39
N$14
  pour Top (isolate 1.016): 0,78 9.5,78 9.5,87.5 83.7,87.5 83.7,78 93.3,78 93.3,9.5 83.7,9.5 83.7,0 9.5,0 9.5,9.5 0,9.5
N$15
  Top 0.203: D12.A 73.4,78.03 70.91,80.52 X8.1
N$16
  Top 0.203: D11.A 70.93,76.92 70.33,77.52 66.04,77.52 65.35,78.22 65.35,83.41 64.54,84.21 58.6,84.21 57.78,83.39 57.78,80.56 X8.3
N$17
  Bottom 0.406: D37.A 31.37,15.96 32.08,16.68 32.08,25.3 R5.2
N$18  (via drill 0.25)
  Top 0.203: v29.47,22.37 29.47,27.71 29.93,28.17 D21.A
  Bottom 0.203: D37.C 30.19,21.64 v29.47,22.37
N$19  (via drill 0.25)
  Top 0.203: v33.89,22.26 33.89,27.78 | 33.89,27.78 33.47,28.2 32.4,28.2 D21.C | 33.89,27.78 33.89,32.62 U5.1
  Bottom 0.203: D5.C 33.86,22.23 v33.89,22.26
N$20
  Bottom 0.406: R6.2 6.49,62.21 5.19,63.51 5.19,71.93 4.69,72.44 D38.A
N$21  (via drill 0.25)
  Top 0.203: D22.A 3.32,60.51 v3.32,65.76
  Bottom 0.203: v3.32,65.76 3.32,68.15 D38.C
N$22  (via drill 0.25)
  Top 0.203: U6.1 6.06,56.04 D22.C 7.08,60.59 v7.08,65.89
  Bottom 0.203: v7.08,65.89 7.08,68.31 D6.C
N$23
  Top 0.203: R16.2 57.02,57 58.91,58.9 58.91,62.95 58.39,63.47 IC1.18
N$24  (via drill 0.35)
  Top 0.203: C8.1 81.95,61.61 80.29,59.95 76.53,59.95 75.52,60.95 v75.52,62.85 | v77.74,69.81 79.31,69.81 U12.4
  Bottom 0.203: v75.52,62.85 75.52,65.69 77.33,67.5 77.33,69.41 v77.74,69.81
N$25
  Bottom 0.406: R7.2 15.46,62.19 13.16,64.48 13.16,71.52 12.27,72.42 D39.A
N$26  (via drill 0.25)
  Top 0.203: D23.A 10.55,59.57 10.03,60.1 10.03,64.88 v11.08,65.93
  Bottom 0.203: v11.08,65.93 D39.C
N$27  (via drill 0.25)
  Top 0.203: U7.1 13.66,55.85 D23.C 14.51,59.57 15.16,60.23 15.16,66.22 v14.94,66.44
  Bottom 0.203: v14.94,66.44 D7.C
N$28
  Bottom 0.406: R8.2 20.78,63.7 20.78,71.91 20.28,72.42 D40.A
N$29  (via drill 0.25)
  Top 0.203: D24.A 18.86,60.88 19.44,61.46 19.44,65.14 v18.83,65.76
  Bottom 0.203: v18.83,65.76 18.83,68.1 D40.C
N$30  (via drill 0.25)
  Top 0.203: U8.1 20.92,59.31 D24.C 20.66,60.92 20.12,61.46 20.12,63.83 22.49,66.19 | 22.49,66.19 | 22.49,66.19 v22.5,66.18
  Bottom 0.203: v22.5,66.18 22.42,66.27 D8.C
N$31
  Top 0.203: R33.1 87.61,50.27 86.81,51.07 85.55,51.07 84.99,51.63 84.99,53.31 PWR.A
N$32
  Top 0.203: R13.2 44.8,64.03 48.17,60.66 54.18,60.66 55.03,61.52 IC1.15
N$33
  Bottom 0.406: R9.2 28.03,63.17 28.03,71.91 27.52,72.42 D41.A
N$34  (via drill 0.25)
  Top 0.203: D25.A 24.91,59.57 24.46,60.03 v24.46,66.04
  Bottom 0.203: D41.C 26.17,67.75 v24.46,66.04
N$35  (via drill 0.25)
  Top 0.203: U9.1 28.92,59.15 | D25.C 28.5,59.57 28.92,59.15 | 28.92,59.15 28.92,65.23 v29.86,66.17
  Bottom 0.203: v29.86,66.17 29.86,68.28 D9.C
N$36
  Bottom 0.406: R10.2 31.71,71.94 32.18,72.42 D42.A
N$37  (via drill 0.25)
  Top 0.203: D26.A 34.36,65.12 v33.76,65.72
  Bottom 0.203: v33.76,65.72 33.76,68.13 D42.C
N$38  (via drill 0.25)
  Top 0.203: U10.1 36.88,58.95 D26.C 36.16,64.25 v38.08,66.17
  Bottom 0.203: v38.08,66.17 38.08,68.35 D10.C
N$39
  Top 0.203: R14.2 46.19,61.89 47.8,60.29 57.54,60.29 57.9,60.65 57.9,61.84 57.57,62.17 IC1.16
N$40
  Top 0.203: R15.2 57.9,59.76 58.41,60.27 58.41,62.5 58.09,62.82 IC1.17
N$41
  Top 0.203: R34.1 87.23,41.33 86.94,41.62 85.37,41.62 84.98,42.02 84.98,43.3 PRS.A
N$42
  Top 0.152: R31.1 71.32,51.57 D14.A
N$43
  Top 0.152: R32.1 D15.A
N$44
  Top 0.203: WRN.A 85.01,34.48 85.55,35.02 86.94,35.02 87.24,35.32 87.24,36.97 R35.1
N$51
  Top 0.152: Q2.1 61.96,16.56 62.62,17.22 R29.1
N$52
  Top 0.152: R30.1 57.15,20.63 Q3.1
N$54
  Top 0.203: U12.7 71.78,66.03 Q1.2 69.56,66.29 68.92,66.92 C1.2
N$55
  Top 0.203: U12.8 79.31,64.79 74.64,64.79 73.77,63.91 73.77,57.29 73.12,56.63 Q1.1 68.75,56.63 67.7,57.69 67.7,72.49 66.92,73.27 C2.2
OUT1  (via drill 0.35)
  Top 0.203: R17.2 v61.31,57.64 60.35,57.64 59.37,58.62 59.37,64.14 58.08,65.44 56.56,65.44 IC1.21 | v4.96,39.04 4.14,39.04 3.02,40.15 U1.4
  Bottom 0.203: v61.31,57.64 61.31,58.28 53.88,65.71 49.31,65.71 42.33,58.73 42.33,46.92 37.21,41.8 37.21,38.39 35.28,36.46 10.57,36.46 7.96,39.07 5,39.07 v4.96,39.04
OUT2  (via drill 0.35)
  Top 0.203: R18.2 v60.9,59.81 59.84,60.86 59.84,64.43 58.19,66.08 56.55,66.08 IC1.22 | U2.4 10.92,39.27 v10.96,39.23
  Bottom 0.203: v10.96,39.23 13.17,37.02 34.95,37.02 36.53,38.61 36.53,41.95 41.6,47.02 41.6,58.89 49.26,66.55 55.16,66.55 59.81,61.9 59.81,60.9 v60.9,59.81
OUT3  (via drill 0.35)
  Top 0.203: R19.2 v61.17,61.99 60.93,61.99 60.36,62.56 60.36,64.75 58.4,66.72 IC1.23 | U3.4 18.62,39.3 v18.72,39.2
  Bottom 0.203: v18.72,39.2 20.18,37.74 34.89,37.74 35.96,38.81 35.96,42.23 41.07,47.34 41.07,59.22 49.16,67.31 56.74,67.31 60.38,63.67 60.38,62.79 v61.17,61.99
OUT4  (via drill 0.35)
  Top 0.203: R20.2 61.3,64.16 v61.27,64.19 61.27,64.9 58.81,67.37 IC1.24 | U4.4 26.38,38.98 v26.75,38.62
  Bottom 0.203: v26.75,38.62 34.9,38.62 35.44,39.15 35.44,42.51 40.56,47.63 40.56,59.62 48.9,67.96 58.36,67.96 61.27,65.05 v61.27,64.19
OUT5  (via drill 0.35)
  Top 0.203: R21.2 61.64,66.31 61.47,66.47 v61.24,66.47 59.7,68.02 IC1.25 | U5.4 34.38,39.68 v34.45,39.61
  Bottom 0.203: v34.45,39.61 34.45,42.38 39.92,47.85 39.92,59.85 48.68,68.61 59.53,68.61 61.24,66.89 v61.24,66.47
OUT6  (via drill 0.35)
  Top 0.203: IC1.26 v61.08,68.67 62.44,68.67 R22.2 | U6.4 7.62,47.1 7.69,47.16 v7.7,47.16
  Bottom 0.203: v7.7,47.16 13.96,47.16 15.15,45.98 21.88,45.98 22.59,45.27 36.51,45.27 39.33,48.09 39.33,60.15 48.45,69.28 60.47,69.28 v61.08,68.67
OUT7  (via drill 0.35)
  Top 0.203: IC1.27 59.99,69.32 v61.35,70.68 62.59,70.68 R23.2 | U7.4 13.41,47.1 v15.71,47.1
  Bottom 0.203: v15.71,47.1 21.64,47.1 22.79,45.95 36.4,45.95 38.76,48.31 38.76,60.4 48.23,69.87 60.54,69.87 v61.35,70.68
OUT8  (via drill 0.35)
  Top 0.203: IC1.28 58.6,69.97 v59.8,71.17 61.37,72.74 62.63,72.74 R24.2 | U8.4 20.98,47.08 v23.48,47.08
  Bottom 0.203: v23.48,47.08 36.42,47.08 38.13,48.79 38.13,60.7 47.9,70.47 59.1,70.47 59.78,71.15 59.78,71.19 v59.8,71.17
OUT9  (via drill 0.35)
  Top 0.203: IC1.1 49.29,71.98 48.64,72.63 v45.86,72.63 43.89,72.63 R25.2 | U9.4 28.92,49 v28.96,49.05
  Bottom 0.203: v28.96,49.05 28.96,53.27 43.9,68.21 43.9,72.21 44.41,72.72 45.76,72.72 v45.86,72.62 v45.86,72.63
OUT10  (via drill 0.35)
  Top 0.203: IC1.2 48.15,69.32 46.98,70.49 v45.45,70.49 43.9,70.49 R26.2 | U10.4 36.88,49.25 v36.84,49.29
  Bottom 0.203: v36.84,49.29 36.84,60.25 45.45,68.86 v45.45,70.49 45.45,70.5
P1
  Bottom 0.813: X1.1 12.87,7.16 R1.1
P2
  Bottom 0.813: X1.2 17.57,7.54 R2.1
P3
  Bottom 0.813: X1.3 22.31,7.88 R3.1
P4
  Bottom 0.813: X1.4 27.01,8.26 R4.1
P5
  Bottom 0.813: X1.5 31.81,8.54 R5.1
P6
  Bottom 0.813: X2.5 12.89,80.33 R6.1
P7
  Bottom 0.813: X2.4 17.59,79.95 R7.1
P8
  Bottom 0.813: X2.3 22.31,79.59 R8.1
P9
  Bottom 0.813: X2.2 27.01,79.21 R9.1
P10
  Bottom 0.813: X2.1 31.71,78.83 R10.1
RTS  (via drill 0.35)
  Top 0.152: R30.2 60.1,18.46 v58.69,18.46 Q2.2
  Top 0.203: U12.14 83.88,71.11 83.21,70.43 v83.19,70.43
  Bottom 0.203: v58.69,18.46 60.27,18.46 61.38,19.57 61.38,22.76 62.13,23.5 70.64,23.5 78.08,30.94 78.08,65.43 83.11,70.46 83.16,70.46 v83.19,70.43
RX  (via drill 0.35)
  Top 0.203: U13.35 62.1,44.6 v62.13,44.57 | v74.29,49.41 73.14,49.41 D15.C | v75.73,68.42 75.73,69.24 77.61,71.11 U12.3
  Bottom 0.203: v62.13,44.57 73.69,44.57 74.61,45.49 74.61,49.09 v74.29,49.41 73.11,50.59 73.11,70.41 73.92,71.22 75.39,71.22 75.73,70.87 v75.73,68.42
RX1  (via drill 0.35)
  Top 0.203: U13.23 56.28,30.87 56.28,28.82 v56.29,28.81 v56.3,28.81 | v76.89,38.75 76.89,40.91 v76.28,41.52
  Bottom 0.203: v56.3,28.81 61.33,28.81 62.71,30.2 75.58,30.2 76.89,31.51 v76.89,38.75 | v76.28,41.52 76.59,41.82 76.59,65.7 80.62,69.73 80.62,71.19 79.25,72.56 49.97,72.56 48.95,73.57 48.95,76.53 49.67,77.25 51.27,77.25 53.52,79.5 53.52,82.67 54.79,83.95 79.34,83.95 80.17,83.12 X4.1
RX_RS485
  Top 0.152: TTL-RS1.RX 76.55,17.68 75.89,18.33 75.89,20.66 74.29,22.27 68.23,22.27 62.4,28.11 62.4,35.25 61.93,35.72 U13.28
SCK_LORA  (via drill 0.35)
  Top 0.203: LORA-NICERF-V1.SCK 62.92,42 v62.59,42.33 | v58.64,38.24 58.65,38.25 U13.30
  Bottom 0.203: v62.59,42.33 60.56,42.33 58.68,40.45 58.68,38.29 v58.64,38.24
SCL  (via drill 0.35)
  Top 0.203: R11.2 45.84,68.33 46.24,67.92 46.24,64.2 47.63,62.82 IC1.12 51.53,62.82 v51.82,63.1 52.22,63.5 52.22,73.9 51.53,74.6 51.53,76.43 51.91,76.82 54.95,76.82 55.3,76.47 ADS1.SCL | v58.41,45.84 60.26,45.84 U13.36
  Bottom 0.203: v51.82,63.1 53.68,63.1 54.2,62.58 54.2,46.58 54.95,45.84 v58.41,45.84 | X7.2 45.6,10.53 46.79,11.72 70.21,11.72 71.48,10.45 80.09,10.45 80.53,10.89 80.53,61.56 85.17,66.2 85.17,71.02 84.41,71.77 82.07,71.77 79.41,74.43 61.8,74.43 61.28,73.91 55.66,73.91 55.28,74.29 55.28,75.31 ADS1.SCL
SDA  (via drill 0.35)
  Top 0.203: R12.2 45.22,66.17 45.77,65.63 45.77,64.03 47.64,62.17 IC1.13 52.3,62.16 | ADS1.SDA 52.76,62.62 52.3,62.16 | 52.3,62.16 53.05,62.16 v53.2,62 | v58.5,42.02 58.54,42.06 U13.33
  Bottom 0.203: v53.2,62 53.2,45.53 56.72,42.02 v58.5,42.02 | X7.3 50.68,9.63 51.72,10.67 70.06,10.67 71.13,9.6 80.08,9.6 81.17,10.69 81.17,61.07 85.89,65.79 85.89,71.89 85.22,72.56 82.23,72.56 79.83,74.96 74.75,74.96 72.96,76.75 54.13,76.75 52.74,75.36 ADS1.SDA
SS_LORA
  Top 0.152: LORA-NICERF-V1.NSS 62.97,38.19 61.77,36.98 U13.29
TX  (via drill 0.35)
  Top 0.203: U13.34 58.2,43.33 v58.06,43.47 | v74.73,51.6 74.71,51.59 D14.C | v74.17,69.89 75.58,69.89 78.07,72.38 U12.2
  Bottom 0.203: v58.06,43.47 73.8,43.47 75.37,45.04 75.37,50.96 v74.73,51.6 74.17,52.16 v74.17,69.89
TX1  (via drill 0.35)
  Top 0.203: U13.13 45.01,33.17 v45.05,33.14
  Bottom 0.203: v45.05,33.14 46.91,33.14 47.42,32.62 68.96,32.62 77.27,40.94 77.27,65.56 81.29,69.59 81.29,71.61 79.67,73.23 52.14,73.23 51.54,73.83 51.54,76.18 52.81,77.45 74.59,77.45 75.09,77.94 X4.2
TX_RS485
  Top 0.152: TTL-RS1.TX 80.62,20.67 81.16,20.14 81.16,16.73 80.68,16.25 76.73,16.25 74.77,18.21 74.77,20.95 73.92,21.8 67.92,21.8 61.99,27.73 61.99,33.94 61.44,34.49 60.34,34.49 U13.27
USB_N
  Top 0.203: J2.2 87.35,70.56 86.73,71.18 86.73,74.9 86.03,75.6 83.19,75.6 82.17,74.58 82.17,68.86 80.59,67.28 79.36,67.28 U12.6
USB_P
  Top 0.203: J2.3 87.55,71.21 87.09,71.67 87.09,75.04 86.28,75.85 | 86.28,75.85 | 86.28,75.85 86.17,75.95 83.04,75.95 82.94,75.85 | 82.94,75.85 | 82.94,75.85 81.81,74.73 81.81,69.16 81.23,68.57 U12.5
VCC  (via drill 0.35)
  Top 0.152: R33.2 84.42,49.7 83.67,50.45 83.67,54.72 v82.75,55.63 81.81,56.58 78.18,56.58 U14.3
  Top 0.203: R23.1 R24.1 64.54,74.82 64.02,75.34 ADS1.VDD | R23.1 R22.1 R21.1 R20.1 64.55,64.15 R19.1 64.55,61.99 R18.1 64.55,59.81 R17.1 64.55,55.06 | R25.1 41.57,70.96 R26.1 41.55,69.59 | 41.55,69.59 41.55,68.34 R11.1 41.53,66.19 | 41.53,66.19 R12.1 | 41.53,66.19 41.52,66.21 39.79,66.21 39.17,65.59 39.17,57.93 40.11,57 R16.1 41.52,55.38 42.23,54.67 64.16,54.67 64.55,55.06 | D13.C 75.83,72.86 D12.C D11.C 70.91,72.85 v70.91,71.04 | 64.55,55.06 64.55,53.93 65.41,53.07 76.73,53.07 78.13,54.47 U14.3 | v42.72,20.03 43.99,20.03 C5.2 | IC1.9 47.85,64.77 47.48,65.14 47.48,68.97 46.85,69.59 41.55,69.59 | TTL-RS1.VCC 80.75,23.65 v82.29,22.11 | R23.1 64.62,70.55 v66.38,70.55
  Bottom 0.203: TTL-RS1.VCC 75.79,23.65 74.73,22.59 74.73,16.38 73.67,15.32 50.6,15.32 45.88,20.04 42.73,20.04 v42.72,20.03 | v82.75,55.63 81.93,54.81 81.93,22.46 v82.29,22.11 | v66.38,70.55 70.43,70.55 v70.91,71.04
VUSB  (via drill 0.35)
  Top 0.203: J2.1 87.44,69.91 | 87.44,69.91 86.87,69.91 86.34,70.44 86.34,73.23 85.92,73.65 U12.16 84.82,73.64 v83.43,73.64 | v77.5,76.27 75.88,76.27 D13.A | v67.59,13.41 68.69,14.5 C9.+ 74.86,14.5 76.75,12.62 82.81,12.62 v83.33,13.14 | C7.1 43.98,17.56 v42.74,17.56 | v87.17,65.75 87.17,69.63 87.44,69.91
  Bottom 0.203: v83.43,73.64 82.05,73.64 79.41,76.27 v77.5,76.27 | v67.59,13.41 67.11,12.93 51.15,12.93 46.51,17.56 v42.74,17.56 | v83.33,13.14 83.33,23.07 82.68,23.73 82.68,53.44 83.87,54.62 83.87,62.26 87.17,65.56 v87.17,65.75